# Altium schematic sheet Ethernet.SchDoc
size A4
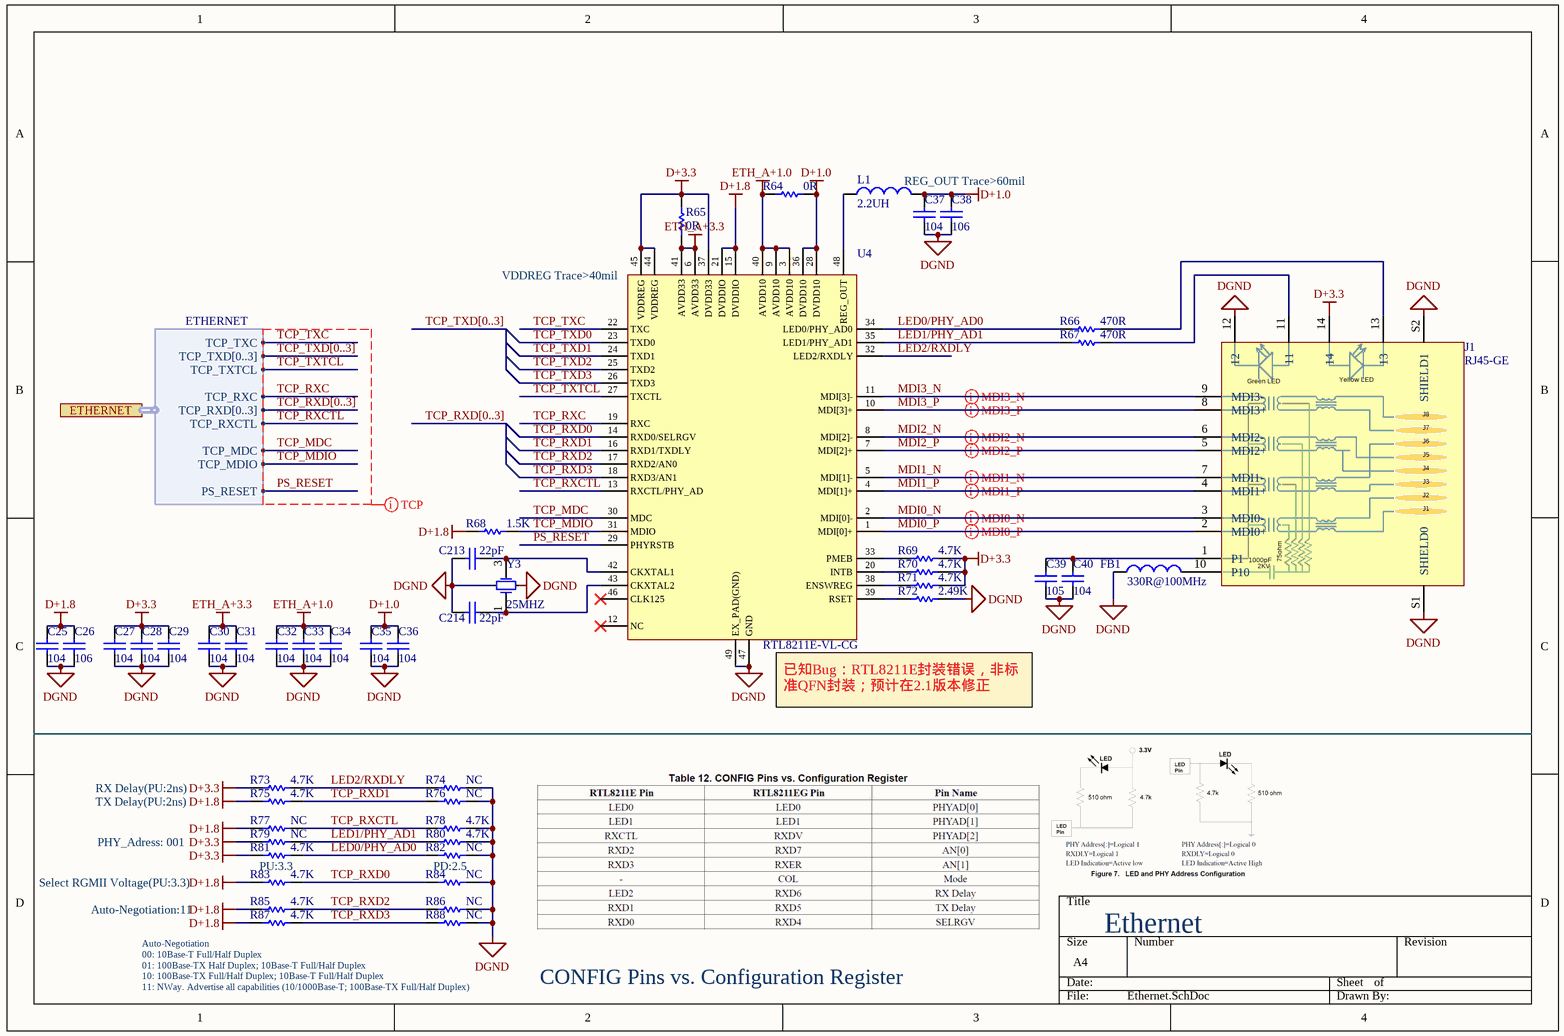
[diagram p0: Ethernet.SchDoc]

## Parts
C25  104  [C 0402_LL]
C26  106  [C 0603_L]
C27  104  [C 0402_LL]
C28  104  [C 0402_LL]
C29  104  [C 0402_LL]
C30  104  [C 0402_LL]
C31  104  [C 0402_LL]
C32  104  [C 0402_LL]
C33  104  [C 0402_LL]
C34  104  [C 0402_LL]
C35  104  [C 0402_LL]
C36  104  [C 0402_LL]
C37  104  [C 0402_LL]
C38  106  [C 0603_L]
C39  105  [C 0603_L]
C40  104  [C 0402_LL]
C213  22pF  [C 0603_L]
C214  22pF  [C 0603_L]
FB1  value 330R@100MHz  [L 0805]  (hidden comment: Ferrite Bead)
J1  RJ45-GE  [RJ45_10]
L1  value 2.2UH  [NR3010]  (hidden comment: Inductor)
R64  0R  [R 0603_L]
R65  0R  [R 0603_L]
R66  470R  [R 0603_L]
R67  470R  [R 0603_L]
R68  1.5K  [R 0603_L]
R69  4.7K  [R 0402_L]
R70  4.7K  [R 0402_L]
R71  4.7K  [R 0402_L]
R72  2.49K  [R 0603_L]
R73  4.7K  [R 0402_L]
R74  NC  [R 0402_L]
R75  4.7K  [R 0402_L]
R76  NC  [R 0402_L]
R77  NC  [R 0402_L]
R78  4.7K  [R 0402_L]
R79  NC  [R 0402_L]
R80  4.7K  [R 0402_L]
R81  4.7K  [R 0402_L]
R82  NC  [R 0402_L]
R83  4.7K  [R 0402_L]
R84  NC  [R 0402_L]
R85  4.7K  [R 0402_L]
R86  NC  [R 0402_L]
R87  4.7K  [R 0402_L]
R88  NC  [R 0402_L]
U4  RTL8211E-VL-CG  [QFN48_RTL8211]
Y3  25MHZ  [OSC 5032-4P]

## Ports
ETHERNET (harness ETHERNET)

## Harnesses
ETHERNET: TCP_TXC, TCP_TXD[0..3], TCP_TXTCL, TCP_RXC, TCP_RXD[0..3], TCP_RXCTL, TCP_MDC, TCP_MDIO, PS_RESET

## Nets
D+1.0: C35.1 C36.1 C37.1 C38.1 L1.2 R64.2 U4.28(DVDD10) U4.36(DVDD10)
D+1.8: C25.1 C26.1 R68.2 R75.2 R77.2 R83.2 R85.2 R87.2 U4.15(DVDDIO) U4.21(DVDDIO)
D+3.3: C27.1 C28.1 C29.1 J1.14 R65.2 R69.1 R70.1 R71.1 R73.2 R79.2 R81.2 U4.37(DVDD33) U4.44(VDDREG) U4.45(VDDREG)
DGND: C25.2 C26.2 C27.2 C28.2 C29.2 C30.2 C31.2 C32.2 C33.2 C34.2 C35.2 C36.2 C37.2 C38.2 C39.2 C40.2 C213.1 C214.1 FB1.1 J1.12 J1.S1(SHIELD0) J1.S2(SHIELD1) R72.1 R74.1 R76.1 R78.1 R80.1 R82.1 R84.1 R86.1 R88.1 U4.47(GND) U4.49(EX_PAD(GND)) Y3.2 Y3.4
ETH_A+1.0: C32.1 C33.1 C34.1 R64.1 U4.3(AVDD10) U4.9(AVDD10) U4.40(AVDD10)
ETH_A+3.3: C30.1 C31.1 R65.1 U4.6(AVDD33) U4.41(AVDD33)
LED0/PHY_AD0: R66.1 R81.1 R82.2 U4.34(LED0/PHY_AD0)
LED1/PHY_AD1: R67.1 R79.1 R80.2 U4.35(LED1/PHY_AD1)
LED2/RXDLY: R73.1 R74.2 U4.32(LED2/RXDLY)
MDI0_N: J1.3(MDI0-) U4.2(MDI[0]-)
MDI0_P: J1.2(MDI0+) U4.1(MDI[0]+)
MDI1_N: J1.7(MDI1-) U4.5(MDI[1]-)
MDI1_P: J1.4(MDI1+) U4.4(MDI[1]+)
MDI2_N: J1.6(MDI2-) U4.8(MDI[2]-)
MDI2_P: J1.5(MDI2+) U4.7(MDI[2]+)
MDI3_N: J1.9(MDI3-) U4.11(MDI[3]-)
MDI3_P: J1.8(MDI3+) U4.10(MDI[3]+)
PS_RESET: U4.29(PHYRSTB) ; port ETHERNET.PS_RESET
TCP_MDC: U4.30(MDC) ; port ETHERNET.TCP_MDC
TCP_MDIO: R68.1 U4.31(MDIO) ; port ETHERNET.TCP_MDIO
TCP_RXC: U4.19(RXC) ; port ETHERNET.TCP_RXC
TCP_RXCTL: R77.1 R78.2 U4.13(RXCTL/PHY_AD) ; port ETHERNET.TCP_RXCTL
TCP_RXD0: R83.1 R84.2 U4.14(RXD0/SELRGV)
TCP_RXD1: R75.1 R76.2 U4.16(RXD1/TXDLY)
TCP_RXD2: R85.1 R86.2 U4.17(RXD2/AN0)
TCP_RXD3: R87.1 R88.2 U4.18(RXD3/AN1)
TCP_TXC: U4.22(TXC) ; port ETHERNET.TCP_TXC
TCP_TXD0: U4.23(TXD0)
TCP_TXD1: U4.24(TXD1)
TCP_TXD2: U4.25(TXD2)
TCP_TXD3: U4.26(TXD3)
TCP_TXTCL: U4.27(TXCTL) ; port ETHERNET.TCP_TXTCL
NetC39_1: C39.1 C40.1 J1.1(P1)
NetC213_2: C213.2 U4.42(CKXTAL1) Y3.3(OSC2)
NetC214_2: C214.2 U4.43(CKXTAL2) Y3.1(OSC1)
NetFB1_2: FB1.2 J1.10(P10)
NetJ1_11: J1.11 R67.2
NetJ1_13: J1.13 R66.2
NetL1_1: L1.1 U4.48(REG_OUT)
NetR69_2: R69.2 U4.33(PMEB)
NetR70_2: R70.2 U4.20(INTB)
NetR71_2: R71.2 U4.38(ENSWREG)
NetR72_2: R72.2 U4.39(RSET)

Not connected (* = marked no-connect by the designer): U4 12(NC)* 46(CLK125)*

## Buses and harness runs
bus TCP_RXD[0..3]
bus TCP_TXD[0..3]

## Layout directives
differential pair; differential pair class MDI3: MDI3_N, MDI3_P
differential pair; differential pair class MDI2: MDI2_N, MDI2_P
differential pair; differential pair class MDI1: MDI1_N, MDI1_P
differential pair; differential pair class MDI0: MDI0_N, MDI0_P
net class TCP: PS_RESET, TCP_MDC, TCP_MDIO, TCP_RXC, TCP_RXCTL, TCP_RXD[0..3], TCP_TXC, TCP_TXD[0..3], TCP_TXTCL

## Notes on the sheet
- (near L1) REG_OUT Trace>60mil
- (near U4) VDDREG Trace>40mil
- (near U4) 已知Bug：RTL8211E封装错误，非标准QFN封装；预计在2.1版本修正
- RX Delay(PU:2ns)
- PHY_Adress: 001
- TX Delay(PU:2ns)
- Select RGMII Voltage(PU:3.3)
- Auto-Negotiation:11
- PU:3.3
- PD:2.5
- Ethernet
- Auto-Negotiation
  00: 10Base-T Full/Half Duplex
  01: 100Base-TX Half Duplex; 10Base-T Full/Half Duplex
  10: 100Base-TX Full/Half Duplex; 10Base-T Full/Half Duplex
  11: NWay. Advertise all capabilities (10/1000Base-T; 100Base-TX Full/Half Duplex)
- CONFIG Pins vs. Configuration Register
- (in symbol RJ45-GE_re) Green LED; Yellow LED; J8; J7; J6; J5; J4; J3; J2; 1000pF; 75ohm; 2KV

## Library data of the parts
C25-C40 C213 C214 = Cap: Capacitor; Published: 8-Jun-2000; LatestRevisionDate: 17-Jul-2002; LatestRevisionNote: Re-released for DXP Platform.; PackageReference: RAD-0.3; Publisher: Altium Limited; PackageDescription: Radial Cap, Thru-Hole; 2 Leads; 0.3 in Pin Spacing
FB1 L1 = Inductor: Code_IEC: 1005; Published: 8-Jun-2000; LatestRevisionDate: 29-May-2009; LatestRevisionNote: IPC-7351 Footprint Added.; PackageReference: 0402-A; Publisher: Altium Limited; PackageDescription: Chip Inductor; Code_JEITA: 0402
J1 = RJ45-GE_re: 千兆以太网接口（带变压器）
R64-R88 = Res1: Resistor; Value: 1K; Published: 8-Jun-2000; LatestRevisionDate: 17-Jul-2002; LatestRevisionNote: Re-released for DXP Platform.; PackageReference: AXIAL-0.3; Publisher: Altium Limited; PackageDescription: Axial Device, Thru-Hole; 2 Leads; 0.3 in Pin Spacing
U4 = RTL8211E: Ethernet PHY / QFN48(E-VB; E-VL; EG-VB)
Y3 = XTAL-4-N: 无源晶振; Manufacturer: NC; value: 25MHZ